# Altium project dcdc.PrjPcb
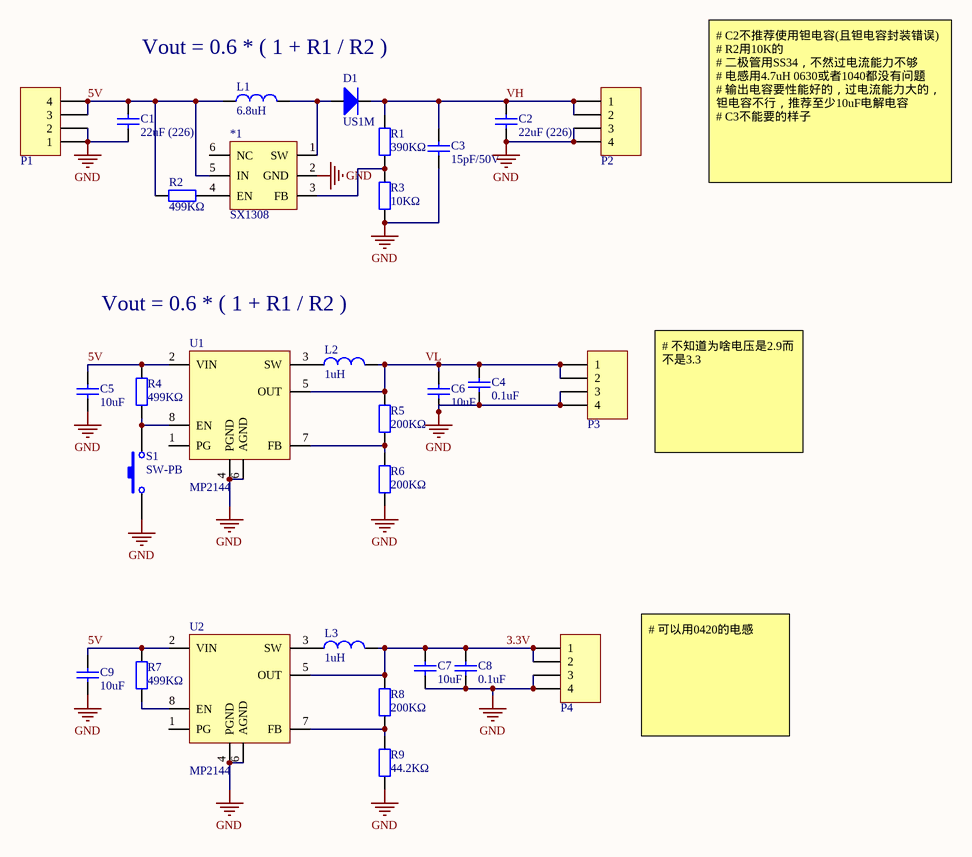
[diagram p0: dcdc.SchDoc]
1 sheet, 30 parts. Net scope: global (net labels, ports and power ports of the same name join across sheets).
Board file: dcdc.PcbDoc

## Sheet dcdc.SchDoc
size A4

### Parts
*1  SX1308  [SOT23-6]
C1  22uF (226)  [0805_C]
C2  22uF (226)  [CAP-7343]
C3  15pF/50V  [0805_C]
C4  0.1uF  [0805_C]
C5  10uF  [0805_C]
C6  10uF  [0805_C]
C7  10uF  [0805_C]
C8  0.1uF  [0805_C]
C9  10uF  [0805_C]
D1  US1M  [DIODE-SMA]
L1  6.8uH  [CDRH104R]
L2  1uH  [06030]
L3  1uH  [06030]
P1  Header 4  [HDR4X1_A]  (value not drawn)
P2  Header 4  [HDR4X1_A]  (value not drawn)
P3  Header 4  [HDR4X1_A]  (value not drawn)
P4  Header 4  [HDR4X1_A]  (value not drawn)
R1  390KΩ  [0805_R]
R2  499KΩ  [0805_R]
R3  10KΩ  [0805_R]
R4  499KΩ  [0805_R]
R5  200KΩ  [0805_R]
R6  200KΩ  [0805_R]
R7  499KΩ  [0805_R]
R8  200KΩ  [0805_R]
R9  44.2KΩ  [0805_R]
S1  SW-PB  [SW_PB2_A2]
U1  MP2144  [TSOT23-8]
U2  MP2144  [TSOT23-8]

### Nets
GND: *1.2(GND) C1.1 C2.1 C3.1 C4.1 C5.1 C6.1 C7.1 C8.1 C9.1 P1.1 P1.2 P2.3 P2.4 P3.3 P3.4 P4.3 P4.4 R3.1 R6.1 R9.1 S1.1 U1.4(PGND) U1.6(AGND) U2.4(PGND) U2.6(AGND)
3.3V: C7.2 C8.2 L3.2 P4.1 P4.2 R8.1 U2.5(OUT)
5V: *1.5(IN) C1.2 C5.2 C9.2 L1.1 P1.3 P1.4 R2.1 R4.2 R7.2 U1.2(VIN) U2.2(VIN)
VH: C2.2 C3.2 D1.2(K) P2.1 P2.2 R1.2
VL: C4.2 C6.2 L2.2 P3.1 P3.2 R5.1 U1.5(OUT)
Net*1_1: *1.1(SW) D1.1(A) L1.2
Net*1_3: *1.3(FB) R1.1 R3.2
Net*1_4: *1.4(EN) R2.2
NetL2_1: L2.1 U1.3(SW)
NetL3_1: L3.1 U2.3(SW)
NetR4_1: R4.1 S1.2 U1.8(EN)
NetR5_2: R5.2 R6.2 U1.7(FB)
NetR7_1: R7.1 U2.8(EN)
NetR8_2: R8.2 R9.2 U2.7(FB)

Not connected (* = marked no-connect by the designer): *1 6(NC); U1 1(PG); U2 1(PG)

### Notes on the sheet
- Vout = 0.6 * ( 1 + R1 / R2 )
- # C2不推荐使用钽电容(且钽电容封装错误)
  # R2用10K的
  # 二极管用SS34，不然过电流能力不够
  # 电感用4.7uH 0630或者1040都没有问题
  # 输出电容要性能好的，过电流能力大的，钽电容不行，推荐至少10uF电解电容
  # C3不能要的样子
- # 不知道为啥电压是2.9而不是3.3
- # 可以用0420的电感

### Library data of the parts
*1 = SX1308: 小体积高效升压电路最高28V
C1-C3 = 0805 22uF (226) 20% 25V: 贴片电容; ComponentLink1Description: 供应商链接; ComponentLink1URL: http://www.szlcsc.com/product/details_46786.html; Package: 0805; Supplier: LC; SuppliersPartNumber: C45783
C4-C9 = 0805 10uF (106) 10% 25V: 贴片电容; ComponentLink1Description: 供应商链接; ComponentLink1URL: http://www.szlcsc.com/product/details_16532.html; Package: 0805; Supplier: LC; SuppliersPartNumber: C15850
D1 = Diode: 二极管; Published: 8-Jun-2000; LatestRevisionDate: 17-Jul-2002; LatestRevisionNote: Re-released for DXP Platform.; PackageDocument: Sep-1996; PackageReference: SMC; Publisher: Altium Limited; Code_JEDEC: DO-214-AB
L1-L3 = Inductor: 电感; Code_IEC: 1005; Published: 8-Jun-2000; LatestRevisionDate: 17-Jul-2002; LatestRevisionNote: Re-released for DXP Platform.; PackageReference: 0402-A; Publisher: Altium Limited; Code_JEITA: 0402
P1-P4 = Header 4: 接插件; LatestRevisionDate: 17-Jul-2002; LatestRevisionNote: Re-released for DXP Platform.; Publisher: Altium Limited
R1 R3 = 0805 1.2KΩ (1201) 1%: 贴片电阻; ComponentLink1Description: 供应商链接; ComponentLink1URL: http://www.szlcsc.com/product/details_18067.html; Package: 0805; Supplier: LC; SuppliersPartNumber: C17379
R2 = 0805 100KΩ (1003) 1%: 贴片电阻; ComponentLink1Description: 供应商链接; ComponentLink1URL: http://www.szlcsc.com/product/details_18095.html; Package: 0805; Supplier: LC; SuppliersPartNumber: C17407
R4-R9 = 0805 200KΩ (2003) 1%: 贴片电阻; ComponentLink1Description: 供应商链接; ComponentLink1URL: http://www.szlcsc.com/product/details_18227.html; Package: 0805; Supplier: LC; SuppliersPartNumber: C17539
S1 = SW-PB: 微动开关key; Published: 24-Mar-1999; LatestRevisionDate: 17-Jul-2002; LatestRevisionNote: Re-released for DXP Platform.; PackageReference: SPST-2; Publisher: Altium Limited
U1 U2 = MP2144: 小体积高效降压 有推荐pcb布局